# EAGLE design quant_v1 (EAGLE 8.7.1)
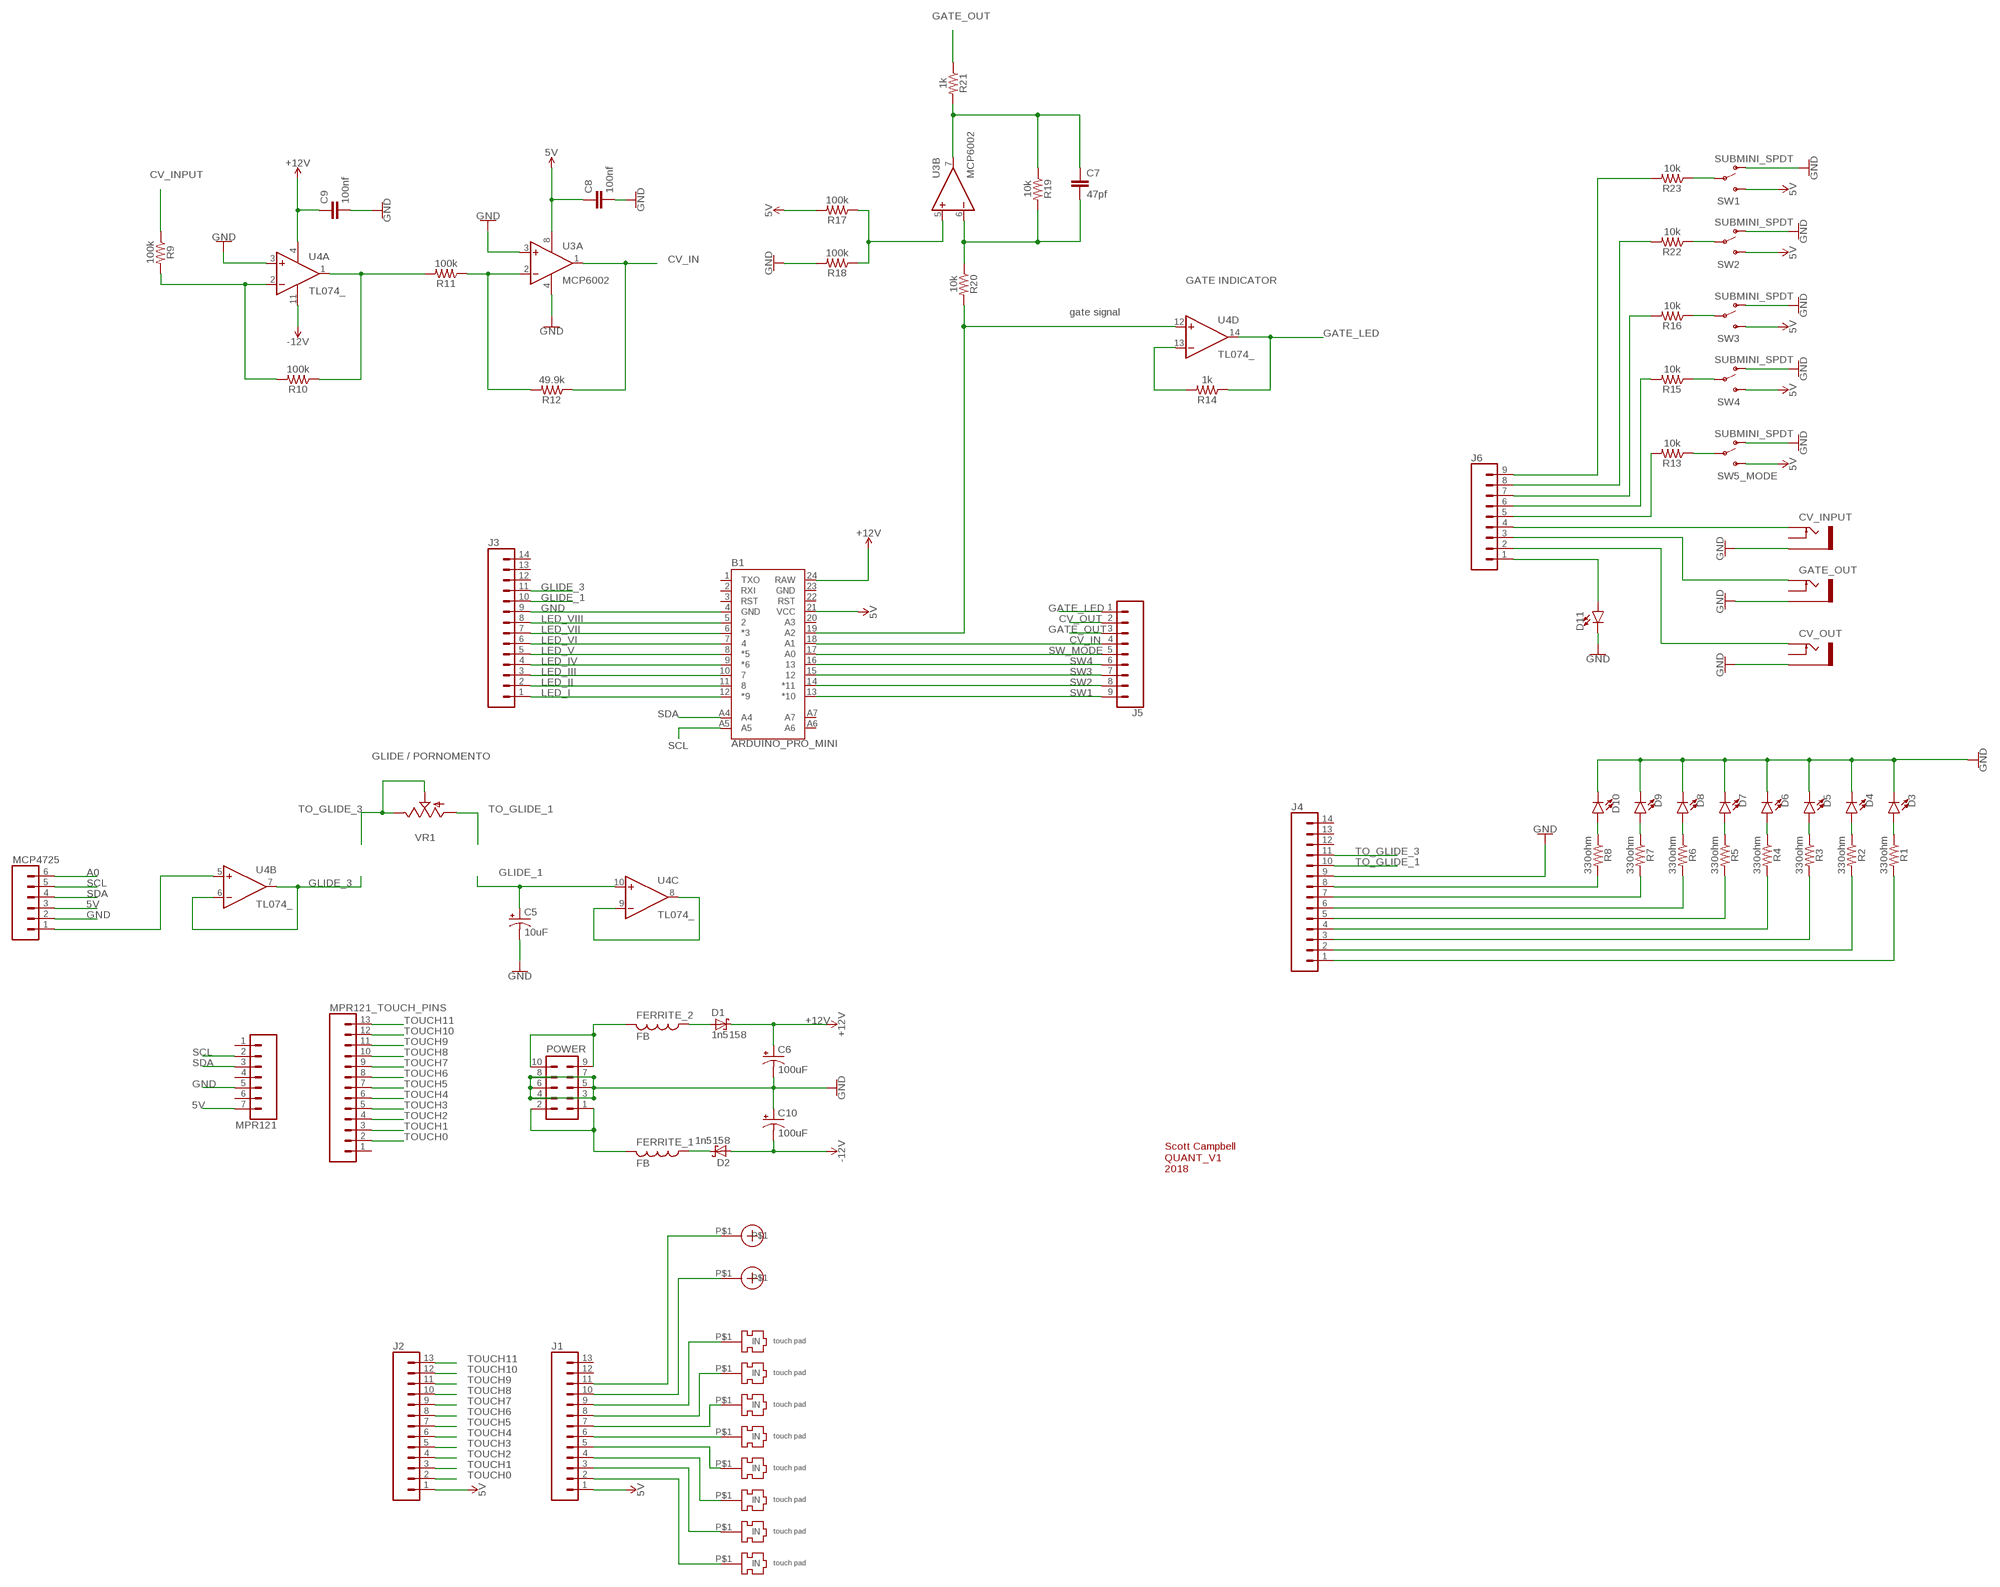
[diagram p0: schematic, sheet 1]

## Parts
B1  ARDUINO_PRO_MINI  [ARDUINO_PRO_MINI]
C5  10uF  10UF-POLAR-RADIAL-2.5MM-25V-20%  [CPOL-RADIAL-2.5MM-5MM]
C6  100uF  100UF-POLAR-RADIAL-2.5MM-25V-20%  [CPOL-RADIAL-2.5MM-6.5MM]
C7  47pf  10NF-PTH-10MM-10000V-1-%  [CAP-PTH-10MM]
C8  100nf  10NF-PTH-10MM-10000V-1-%  [CAP-PTH-10MM]
C9  100nf  10NF-PTH-10MM-10000V-1-%  [CAP-PTH-10MM]
C10  100uF  100UF-POLAR-RADIAL-2.5MM-25V-20%  [CPOL-RADIAL-2.5MM-6.5MM]
CV_INPUT  THONKICONNNEW  [WQP-PJ301M-12_JACK]
CV_OUT  CV_OUT  THONKICONNNEW  [WQP-PJ301M-12_JACK]
D1  1n5158  SCHOTTKY-DIODEDO41  [DO41-10]
D2  1n5158  SCHOTTKY-DIODEDO41  [DO41-10]
D3  LED3MM  [LED_3MM]
D4  LED3MM  [LED_3MM]
D5  LED3MM  [LED_3MM]
D6  LED3MM  [LED_3MM]
D7  LED3MM  [LED_3MM]
D8  LED3MM  [LED_3MM]
D9  LED3MM  [LED_3MM]
D10  LED3MM  [LED_3MM]
D11  LED3MM  [LED_3MM]
FERRITE_1  FB  [FB]
FERRITE_2  FB  [FB]
GATE_OUT  GATE_OUT  THONKICONNNEW  [WQP-PJ301M-12_JACK]
J1  CONN_13  [1X13]
J2  CONN_13  [1X13]
J3  CONN_14  [1X14]
J4  CONN_14  [1X14]
J5  CONN_09  [1X09]
J6  CONN_09  [1X09]
MCP4725  CONN_06NO_SILK_FEMALE_PTH  [1X06_NO_SILK]
MPR121  CONN_07  [1X07]
MPR121_TOUCH_PINS  CONN_13  [1X13]
POWER  EURO_POWER_HEADERREGULAR  [EURO_POWER_HEADER]
R1  330ohm  1KOHM-HORIZ-1/4W-5%  [AXIAL-0.3]
R2  330ohm  1KOHM-HORIZ-1/4W-5%  [AXIAL-0.3]
R3  330ohm  1KOHM-HORIZ-1/4W-5%  [AXIAL-0.3]
R4  330ohm  1KOHM-HORIZ-1/4W-5%  [AXIAL-0.3]
R5  330ohm  1KOHM-HORIZ-1/4W-5%  [AXIAL-0.3]
R6  330ohm  1KOHM-HORIZ-1/4W-5%  [AXIAL-0.3]
R7  330ohm  1KOHM-HORIZ-1/4W-5%  [AXIAL-0.3]
R8  330ohm  1KOHM-HORIZ-1/4W-5%  [AXIAL-0.3]
R9  100k  1KOHM-HORIZ-1/4W-5%  [AXIAL-0.3]
R10  100k  1KOHM-HORIZ-1/4W-5%  [AXIAL-0.3]
R11  100k  1KOHM-HORIZ-1/4W-5%  [AXIAL-0.3]
R12  49.9k  1KOHM-HORIZ-1/4W-5%  [AXIAL-0.3]
R13  10k  1KOHM-HORIZ-1/4W-5%  [AXIAL-0.3]
R14  1k  1KOHM-HORIZ-1/4W-5%  [AXIAL-0.3]
R15  10k  1KOHM-HORIZ-1/4W-5%  [AXIAL-0.3]
R16  10k  1KOHM-HORIZ-1/4W-5%  [AXIAL-0.3]
R17  100k  1KOHM-HORIZ-1/4W-5%  [AXIAL-0.3]
R18  100k  1KOHM-HORIZ-1/4W-5%  [AXIAL-0.3]
R19  10k  1KOHM-HORIZ-1/4W-5%  [AXIAL-0.3]
R20  10k  1KOHM-HORIZ-1/4W-5%  [AXIAL-0.3]
R21  1k  1KOHM-HORIZ-1/4W-5%  [AXIAL-0.3]
R22  10k  1KOHM-HORIZ-1/4W-5%  [AXIAL-0.3]
R23  10k  1KOHM-HORIZ-1/4W-5%  [AXIAL-0.3]
SW1  SUBMINI_SPDT  [SUBMINI_TOGGLE]
SW2  SUBMINI_SPDT  [SUBMINI_TOGGLE]
SW3  SUBMINI_SPDT  [SUBMINI_TOGGLE]
SW4  SUBMINI_SPDT  [SUBMINI_TOGGLE]
SW5_MODE  SUBMINI_SPDT  [SUBMINI_TOGGLE]
TOUCH_I  TOUCH_PAD_ESSY  [TOUCH_PAD_ESSY]
TOUCH_II  TOUCH_PAD_ESSY  [TOUCH_PAD_ESSY]
TOUCH_III  TOUCH_PAD_ESSY  [TOUCH_PAD_ESSY]
TOUCH_IV  TOUCH_PAD_ESSY  [TOUCH_PAD_ESSY]
TOUCH_V  TOUCH_PAD_ESSY  [TOUCH_PAD_ESSY]
TOUCH_VI  TOUCH_PAD_ESSY  [TOUCH_PAD_ESSY]
TOUCH_VII  TOUCH_PAD_ESSY  [TOUCH_PAD_ESSY]
TOUCH_VIII  touch_8  TOUCH_PAD_ESSY  [TOUCH_PAD_ESSY]
U3  MCP6002  TL072_  [DIL08]
U4  TL074_  [DIL14]
U$1  TOUCH_PAD_INCREMENT  [TOUCH_PAD_INCREMENT]
U$2  TOUCH_PAD_INCREMENT  [TOUCH_PAD_INCREMENT]
VR1  9MM_SNAP-IN_POT_  [9MM_SNAP-IN_POT]

## Nets
5V: B1.21(VCC) C8.1 C10.2(-) D2.A J1.1 J2.1 MCP4725.3 MPR121.7 R17.P$2 SW1.3(S) SW2.3(S) SW3.3(S) SW4.3(S) U3.8(P:V+) ; supply symbol labelled -12V
+12V: B1.24(RAW) C6.1(+) C9.1 D1.C U4.4(P:V+)
-12V: U4.11(P:V-)
A0: MCP4725.6
CV_IN: B1.18(A1) J5.4 R12.P$1 U3.1(A:OUT)
CV_INPUT: R9.P$1
CV_OUT: J5.2 U4.8(C:OUT) U4.9(C:-IN)
GATE_LED: J5.1 R14.P$1 U4.14(D:OUT)
GATE_OUT: J5.3 R21.P$1
GLIDE_1: C5.1(+) J3.10 U4.10(C:+IN)
GLIDE_3: J3.11 U4.6(B:-IN) U4.7(B:OUT)
GND: B1.4(GND) C5.2(-) C6.2(-) C8.2 C9.2 C10.1(+) CV_INPUT.P$3_SLEEVE(SLEEVE) CV_OUT.P$3_SLEEVE(SLEEVE) D3.K(C) D4.K(C) D5.K(C) D6.K(C) D7.K(C) D8.K(C) D9.K(C) D10.K(C) D11.K(C) GATE_OUT.P$3_SLEEVE(SLEEVE) J3.9 J4.9 MCP4725.2 MPR121.5 POWER.3 POWER.4 POWER.5 POWER.6 POWER.7 POWER.8 R18.P$2 SW1.1(O) SW2.1(O) SW3.1(O) SW4.1(O) SW5_MODE.1(O) U3.3(A:+IN) U3.4(P:V-) U4.3(A:+IN)
LED_I: B1.12(*9) J3.1
LED_II: B1.11 J3.2
LED_III: B1.10 J3.3
LED_IV: B1.9(*6) J3.4
LED_V: B1.8(*5) J3.5
LED_VI: B1.7 J3.6
LED_VII: B1.6(*3) J3.7
LED_VIII: B1.5 J3.8
N$1: FERRITE_2.P$2 POWER.9 POWER.10
N$2: D2.C FERRITE_1.P$1
N$3: D1.A FERRITE_2.P$1
N$4: R23.P$1 SW1.COM(COMMON)
N$5: D3.A R1.P$1
N$6: R22.P$1 SW2.COM(COMMON)
N$7: R16.P$1 SW3.COM(COMMON)
N$8: R15.P$1 SW4.COM(COMMON)
N$9: J6.9 R23.P$2
N$10: CV_INPUT.P$1_TIP(TIP) J6.4
N$11: J6.7 R16.P$2
N$12: J6.6 R15.P$2
N$13: D10.A R8.P$1
N$14: D9.A R7.P$1
N$15: D8.A R6.P$1
N$16: D7.A R5.P$1
N$17: D6.A R4.P$1
N$18: D5.A R3.P$1
N$19: D4.A R2.P$1
N$20: MCP4725.1 U4.5(B:+IN)
N$21: GATE_OUT.P$1_TIP(TIP) J6.3
N$22: CV_OUT.P$1_TIP(TIP) J6.2
N$23: D11.A J6.1
N$24: R9.P$2 R10.P$2 U4.2(A:-IN)
N$25: J6.8 R22.P$2
N$26: J4.8 R8.P$2
N$27: R13.P$1 SW5_MODE.COM(COMMON)
N$28: R10.P$1 R11.P$2 U4.1(A:OUT)
N$29: R11.P$1 R12.P$2 U3.2(A:-IN)
N$30: R17.P$1 R18.P$1 U3.5(B:+IN)
N$31: J6.5 R13.P$2
N$32: R14.P$2 U4.13(D:-IN)
N$33: J4.7 R7.P$2
N$34: FERRITE_1.P$2 POWER.1 POWER.2
N$35: J4.6 R6.P$2
N$36: J4.5 R5.P$2
N$37: B1.19(A2) R20.P$2 U4.12(D:+IN)
N$38: C7.2 R19.P$2 R20.P$1 U3.6(B:-IN)
N$39: C7.1 R19.P$1 R21.P$2 U3.7(B:OUT)
N$40: J4.4 R4.P$2
N$41: J4.3 R3.P$2
N$42: J4.2 R2.P$2
N$43: J4.1 R1.P$2
N$44: J1.2 TOUCH_I.P$1(IN)
N$45: J1.3 TOUCH_II.P$1(IN)
N$46: J1.4 TOUCH_III.P$1(IN)
N$47: J1.5 TOUCH_IV.P$1(IN)
N$48: J1.6 TOUCH_V.P$1(IN)
N$49: J1.7 TOUCH_VI.P$1(IN)
N$50: J1.8 TOUCH_VII.P$1(IN)
N$51: J1.9 TOUCH_VIII.P$1(IN)
N$52: J1.10 U$2.P$1
N$53: J1.11 U$1.P$1
SCL: B1.A5 MCP4725.5 MPR121.2
SDA: B1.A4 MCP4725.4 MPR121.3
SW1: B1.13(*10) J5.9
SW2: B1.14(*11) J5.8
SW3: B1.15 J5.7
SW4: B1.16 J5.6
SW_MODE: B1.17(A0) J5.5
TO_GLIDE_1: J4.10 VR1.1(A)
TO_GLIDE_3: J4.11 VR1.2(S) VR1.3(E)
TOUCH0: J2.2 MPR121_TOUCH_PINS.2
TOUCH1: J2.3 MPR121_TOUCH_PINS.3
TOUCH2: J2.4 MPR121_TOUCH_PINS.4
TOUCH3: J2.5 MPR121_TOUCH_PINS.5
TOUCH4: J2.6 MPR121_TOUCH_PINS.6
TOUCH5: J2.7 MPR121_TOUCH_PINS.7
TOUCH6: J2.8 MPR121_TOUCH_PINS.8
TOUCH7: J2.9 MPR121_TOUCH_PINS.9
TOUCH8: J2.10 MPR121_TOUCH_PINS.10
TOUCH9: J2.11 MPR121_TOUCH_PINS.11
TOUCH10: J2.12 MPR121_TOUCH_PINS.12
TOUCH11: J2.13 MPR121_TOUCH_PINS.13
Unconnected: B1.1(TXO) B1.2(RXI) B1.3(RST) B1.20(A3) B1.22(RST) B1.A6 B1.A7 CV_INPUT.P$2_SWITCH(SWITCH) CV_OUT.P$2_SWITCH(SWITCH) GATE_OUT.P$2_SWITCH(SWITCH) J1.12 J1.13 J3.12 J3.13 J3.14 J4.12 J4.13 J4.14 MPR121.1 MPR121.4 MPR121.6 MPR121_TOUCH_PINS.1 SW5_MODE.3(S)

## Notes on the sheet
- GATE INDICATOR
- gate signal
- GLIDE / PORNOMENTO
- Scott Campbell
  QUANT_V1
  2018

## Power pins joined to a net without a drawn wire
GND: B1.23(GND)

## Library data of the parts
B1 = SparkFun-Boards:ARDUINO_PRO_MINI: SparkFun Pro Mini Pro Mini compatible footprint. Dimensions: 0.7 x 1.3" PCB Thickness: 0.8mm SparkFun Products: 3.3V/8MHz <https://www.sparkfun.com/products/11114> 5V/16MHz <https://www.sparkfun.com/products/11113>
C5 = SparkFun-Capacitors:10UF-POLAR: 10.0µF polarized capacitors A capacitor is a passive two-terminal electrical component used to store electrical energy temporarily in an electric field.; PROD_ID: CAP-08440
C6 C10 = SparkFun-Capacitors:100UF-POLAR: 100µF polarized capacitors A capacitor is a passive two-terminal electrical component used to store electrical energy temporarily in an electric field.; PROD_ID: CAP-08439
C7-C9 = SparkFun-Capacitors:10NF: 0.01uF/10nF/10,000pF ceramic capacitors A capacitor is a passive two-terminal electrical component used to store electrical energy temporarily in an electric field. CAP-09321; PROD_ID: CAP-09321; VALUE: 10nF
CV_INPUT CV_OUT GATE_OUT = MusicThingModular:THONKICONN: 3.5mm socket for Eurorack modular synths
D1 D2 = adafruit:SCHOTTKY-DIODE: Schottky Diode
D3-D11 = SparkFun-LED:LED: LED (Generic) Standard schematic elements and footprints for 5mm, 3mm, 1206, and 0603 sized LEDs. Generic LEDs with no color specified.; PROD_ID: DIO-08794
FERRITE_1 FERRITE_2 = adafruit:FB: Ferrite bead Digikey #P9821BK-ND
J1 J2 = SparkFun-Connectors:CONN_13: Multi connection point. Often used as Generic Header-pin footprint for 0.1 inch spaced/style header connections On any of the 0.1 inch spaced packages, you can populate with these: Break Away Headers - Straight <https://www.sparkfun.com/products/116> (PRT-00116) Break Away Male Headers - Right Angle <https://www.sparkfun.com/products/553> (PRT-00553) Female Headers <https://www.sparkfun.com/products/115> (PRT-00115) Break Away Headers - Machine Pin <https://www.sparkfun.com/products/117> (PRT-00117) Break Away Female Headers - Swiss Machine Pin <https://www.sparkfun.com/products/743> (PRT-00743) For SCREWTERMINALS and SPRING TERMINALS visit here: Screw Terimnals on SparkFun.com <https://www.sparkfun.com/search/results?term=Screw+Terminals> (5mm/3.5mm/2.54mm spacing) This device is also useful as a general connection point to wire up your design to another part of your project. Our various solder wires solder well into these plated through hole pads. Hook-Up Wire - Assortment (Stranded, 22 AWG) <https://www.sparkfun.com/products/11375> (PRT-11375) Hook-Up Wire - Assortment (Solid Core, 22 AWG) <https://www.sparkfun.com/products/11367> (PRT-11367) View the entire wire category on our website here <https://www.sparkfun.com/categories/141> Special notes: Molex polarized connector foot print use with SKU : PRT-08231 with associated crimp pins and housings. 1MM SMD Version SKU: PRT-10208 NOTES ON THE VARIANTS LOCK and LOCK_LONGPADS... This footprint was designed to help hold the alignment of a through-hole component (i.e. 6-pin header) while soldering it into place. You may notice that each hole has been shifted either up or down by 0.005 of an inch from it's more standard position (which is a perfectly straight line). This slight alteration caused the pins (the squares in the middle) to touch the edges of the holes. Because they are alternating, it causes a "brace" to hold the component in place. 0.005 has proven to be the perfect amount of "off-center" position when using our standard breakaway headers. Although looks a little odd when you look at the bare footprint, once you have a header in there, the alteration is very hard to notice. Also,if you push a header all the way into place, it is covered up entirely on the bottom side.; SPICEPREFIX: X
J3 J4 = SparkFun-Connectors:CONN_14: Multi connection point. Often used as Generic Header-pin footprint for 0.1 inch spaced/style header connections On any of the 0.1 inch spaced packages, you can populate with these: Break Away Headers - Straight <https://www.sparkfun.com/products/116> (PRT-00116) Break Away Male Headers - Right Angle <https://www.sparkfun.com/products/553> (PRT-00553) Female Headers <https://www.sparkfun.com/products/115> (PRT-00115) Break Away Headers - Machine Pin <https://www.sparkfun.com/products/117> (PRT-00117) Break Away Female Headers - Swiss Machine Pin <https://www.sparkfun.com/products/743> (PRT-00743) For SCREWTERMINALS and SPRING TERMINALS visit here: Screw Terimnals on SparkFun.com <https://www.sparkfun.com/search/results?term=Screw+Terminals> (5mm/3.5mm/2.54mm spacing) This device is also useful as a general connection point to wire up your design to another part of your project. Our various solder wires solder well into these plated through hole pads. Hook-Up Wire - Assortment (Stranded, 22 AWG) <https://www.sparkfun.com/products/11375> (PRT-11375) Hook-Up Wire - Assortment (Solid Core, 22 AWG) <https://www.sparkfun.com/products/11367> (PRT-11367) View the entire wire category on our website here <https://www.sparkfun.com/categories/141> Special notes: Molex polarized connector foot print use with SKU : PRT-08231 with associated crimp pins and housings. 1MM SMD Version SKU: PRT-10208 NOTES ON THE VARIANTS LOCK and LOCK_LONGPADS... This footprint was designed to help hold the alignment of a through-hole component (i.e. 6-pin header) while soldering it into place. You may notice that each hole has been shifted either up or down by 0.005 of an inch from it's more standard position (which is a perfectly straight line). This slight alteration caused the pins (the squares in the middle) to touch the edges of the holes. Because they are alternating, it causes a "brace" to hold the component in place. 0.005 has proven to be the perfect amount of "off-center" position when using our standard breakaway headers. Although looks a little odd when you look at the bare footprint, once you have a header in there, the alteration is very hard to notice. Also,if you push a header all the way into place, it is covered up entirely on the bottom side.
J5 J6 = SparkFun-Connectors:CONN_09: Multi connection point. Often used as Generic Header-pin footprint for 0.1 inch spaced/style header connections On any of the 0.1 inch spaced packages, you can populate with these: Break Away Headers - Straight <https://www.sparkfun.com/products/116> (PRT-00116) Break Away Male Headers - Right Angle <https://www.sparkfun.com/products/553> (PRT-00553) Female Headers <https://www.sparkfun.com/products/115> (PRT-00115) Break Away Headers - Machine Pin <https://www.sparkfun.com/products/117> (PRT-00117) Break Away Female Headers - Swiss Machine Pin <https://www.sparkfun.com/products/743> (PRT-00743) For SCREWTERMINALS and SPRING TERMINALS visit here: Screw Terimnals on SparkFun.com <https://www.sparkfun.com/search/results?term=Screw+Terminals> (5mm/3.5mm/2.54mm spacing) This device is also useful as a general connection point to wire up your design to another part of your project. Our various solder wires solder well into these plated through hole pads. Hook-Up Wire - Assortment (Stranded, 22 AWG) <https://www.sparkfun.com/products/11375> (PRT-11375) Hook-Up Wire - Assortment (Solid Core, 22 AWG) <https://www.sparkfun.com/products/11367> (PRT-11367) View the entire wire category on our website here <https://www.sparkfun.com/categories/141> Special notes: Molex polarized connector foot print use with SKU : PRT-08231 with associated crimp pins and housings. 1MM SMD Version SKU: PRT-10208 NOTES ON THE VARIANTS LOCK and LOCK_LONGPADS... This footprint was designed to help hold the alignment of a through-hole component (i.e. 6-pin header) while soldering it into place. You may notice that each hole has been shifted either up or down by 0.005 of an inch from it's more standard position (which is a perfectly straight line). This slight alteration caused the pins (the squares in the middle) to touch the edges of the holes. Because they are alternating, it causes a "brace" to hold the component in place. 0.005 has proven to be the perfect amount of "off-center" position when using our standard breakaway headers. Although looks a little odd when you look at the bare footprint, once you have a header in there, the alteration is very hard to notice. Also,if you push a header all the way into place, it is covered up entirely on the bottom side.
MCP4725 = SparkFun-Connectors:CONN_06: Multi connection point. Often used as Generic Header-pin footprint for 0.1 inch spaced/style header connections On any of the 0.1 inch spaced packages, you can populate with these: Break Away Headers - Straight <https://www.sparkfun.com/products/116> (PRT-00116) Break Away Male Headers - Right Angle <https://www.sparkfun.com/products/553> (PRT-00553) Female Headers <https://www.sparkfun.com/products/115> (PRT-00115) Break Away Headers - Machine Pin <https://www.sparkfun.com/products/117> (PRT-00117) Break Away Female Headers - Swiss Machine Pin <https://www.sparkfun.com/products/743> (PRT-00743) Arduino Stackable Header - 6 Pin <https://www.sparkfun.com/products/9280> (PRT-09280) For SCREWTERMINALS and SPRING TERMINALS visit here: Screw Terimnals on SparkFun.com <https://www.sparkfun.com/search/results?term=Screw+Terminals> (5mm/3.5mm/2.54mm spacing) This device is also useful as a general connection point to wire up your design to another part of your project. Our various solder wires solder well into these plated through hole pads. Hook-Up Wire - Assortment (Stranded, 22 AWG) <https://www.sparkfun.com/products/11375> (PRT-11375) Hook-Up Wire - Assortment (Solid Core, 22 AWG) <https://www.sparkfun.com/products/11367> (PRT-11367) View the entire wire category on our website here <https://www.sparkfun.com/categories/141>; PROD_ID: CONN-08437
MPR121 = SparkFun-Connectors:CONN_07: Multi connection point. Often used as Generic Header-pin footprint for 0.1 inch spaced/style header connections On any of the 0.1 inch spaced packages, you can populate with these: Break Away Headers - Straight <https://www.sparkfun.com/products/116> (PRT-00116) Break Away Male Headers - Right Angle <https://www.sparkfun.com/products/553> (PRT-00553) Female Headers <https://www.sparkfun.com/products/115> (PRT-00115) Break Away Headers - Machine Pin <https://www.sparkfun.com/products/117> (PRT-00117) Break Away Female Headers - Swiss Machine Pin <https://www.sparkfun.com/products/743> (PRT-00743) For SCREWTERMINALS and SPRING TERMINALS visit here: Screw Terimnals on SparkFun.com <https://www.sparkfun.com/search/results?term=Screw+Terminals> (5mm/3.5mm/2.54mm spacing) This device is also useful as a general connection point to wire up your design to another part of your project. Our various solder wires solder well into these plated through hole pads. Hook-Up Wire - Assortment (Stranded, 22 AWG) <https://www.sparkfun.com/products/11375> (PRT-11375) Hook-Up Wire - Assortment (Solid Core, 22 AWG) <https://www.sparkfun.com/products/11367> (PRT-11367) View the entire wire category on our website here <https://www.sparkfun.com/categories/141> Special notes: Molex polarized connector foot print use with SKU : PRT-08231 with associated crimp pins and housings. 1MM SMD Version SKU: PRT-10208 NOTES ON THE VARIANTS LOCK and LOCK_LONGPADS... This footprint was designed to help hold the alignment of a through-hole component (i.e. 6-pin header) while soldering it into place. You may notice that each hole has been shifted either up or down by 0.005 of an inch from it's more standard position (which is a perfectly straight line). This slight alteration caused the pins (the squares in the middle) to touch the edges of the holes. Because they are alternating, it causes a "brace" to hold the component in place. 0.005 has proven to be the perfect amount of "off-center" position when using our standard breakaway headers. Although looks a little odd when you look at the bare footprint, once you have a header in there, the alteration is very hard to notice. Also,if you push a header all the way into place, it is covered up entirely on the bottom side.
MPR121_TOUCH_PINS = SparkFun-Connectors:CONN_13: Multi connection point. Often used as Generic Header-pin footprint for 0.1 inch spaced/style header connections On any of the 0.1 inch spaced packages, you can populate with these: Break Away Headers - Straight <https://www.sparkfun.com/products/116> (PRT-00116) Break Away Male Headers - Right Angle <https://www.sparkfun.com/products/553> (PRT-00553) Female Headers <https://www.sparkfun.com/products/115> (PRT-00115) Break Away Headers - Machine Pin <https://www.sparkfun.com/products/117> (PRT-00117) Break Away Female Headers - Swiss Machine Pin <https://www.sparkfun.com/products/743> (PRT-00743) For SCREWTERMINALS and SPRING TERMINALS visit here: Screw Terimnals on SparkFun.com <https://www.sparkfun.com/search/results?term=Screw+Terminals> (5mm/3.5mm/2.54mm spacing) This device is also useful as a general connection point to wire up your design to another part of your project. Our various solder wires solder well into these plated through hole pads. Hook-Up Wire - Assortment (Stranded, 22 AWG) <https://www.sparkfun.com/products/11375> (PRT-11375) Hook-Up Wire - Assortment (Solid Core, 22 AWG) <https://www.sparkfun.com/products/11367> (PRT-11367) View the entire wire category on our website here <https://www.sparkfun.com/categories/141> Special notes: Molex polarized connector foot print use with SKU : PRT-08231 with associated crimp pins and housings. 1MM SMD Version SKU: PRT-10208 NOTES ON THE VARIANTS LOCK and LOCK_LONGPADS... This footprint was designed to help hold the alignment of a through-hole component (i.e. 6-pin header) while soldering it into place. You may notice that each hole has been shifted either up or down by 0.005 of an inch from it's more standard position (which is a perfectly straight line). This slight alteration caused the pins (the squares in the middle) to touch the edges of the holes. Because they are alternating, it causes a "brace" to hold the component in place. 0.005 has proven to be the perfect amount of "off-center" position when using our standard breakaway headers. Although looks a little odd when you look at the bare footprint, once you have a header in there, the alteration is very hard to notice. Also,if you push a header all the way into place, it is covered up entirely on the bottom side.
POWER = MusicThingModular:EURO_POWER_HEADER: Power Header 10 pin power header for Eurorack Power Supplies Variants with fatter pads for easier soldering, and the LOCK variant which has 5mil offset pins to hold the component in place before soldering
R1-R13 R15-R20 R22 R23 = SparkFun-Resistors:1KOHM: 1kΩ resistor A resistor is a passive two-terminal electrical component that implements electrical resistance as a circuit element. Resistors act to reduce current flow, and, at the same time, act to lower voltage levels within circuits. - Wikipedia; PROD_ID: RES-08380; VALUE: 1k
R14 R21 = SparkFun-Resistors:1KOHM: 1kΩ resistor A resistor is a passive two-terminal electrical component that implements electrical resistance as a circuit element. Resistors act to reduce current flow, and, at the same time, act to lower voltage levels within circuits. - Wikipedia; PROD_ID: RES-08380
SW1-SW4 SW5_MODE = MusicThingModular:SUBMINI_SPDT
TOUCH_I TOUCH_II TOUCH_III TOUCH_IV TOUCH_V TOUCH_VI TOUCH_VII TOUCH_VIII = ESSY:TOUCH_PAD_ESSY
U3 = MusicThingModular:TL072: Generic Dual Op Amp
U4 = MusicThingModular:TL074: Generic Quad Op Amp
U$1 U$2 = ESSY:TOUCH_PAD_INCREMENT
VR1 = MusicThingModular:9MM_SNAP-IN_POT: 9mm vertical snap-in pot, Alpha / Panasonic style

## Board
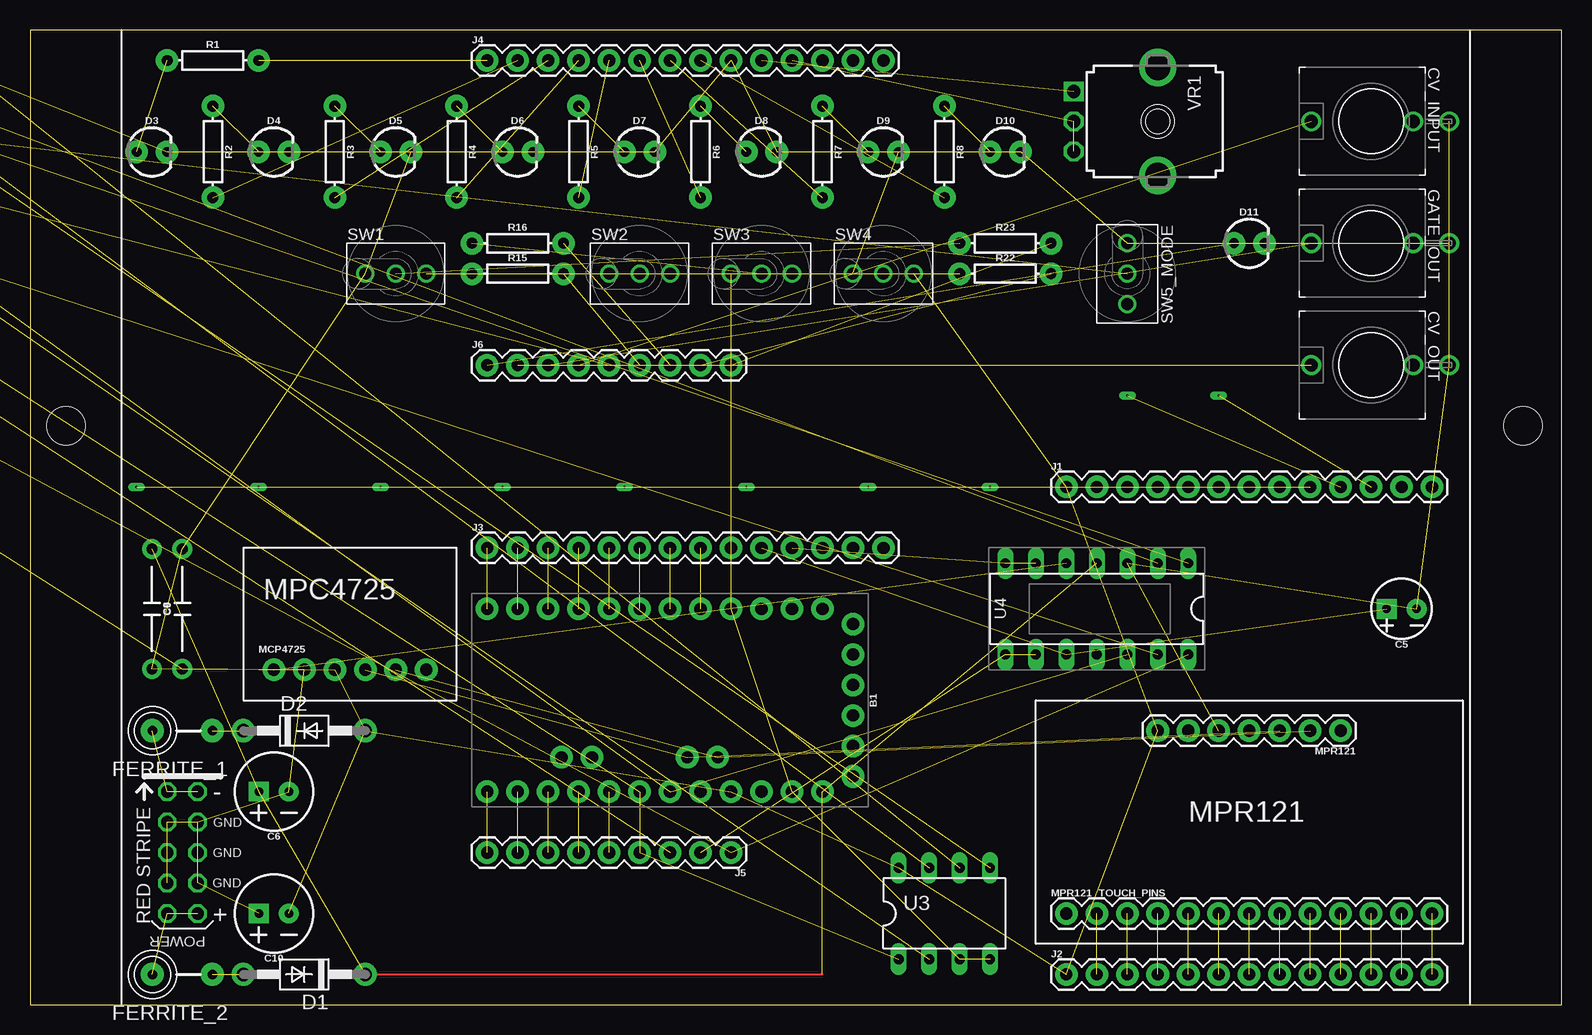
[diagram p1: board, top side]
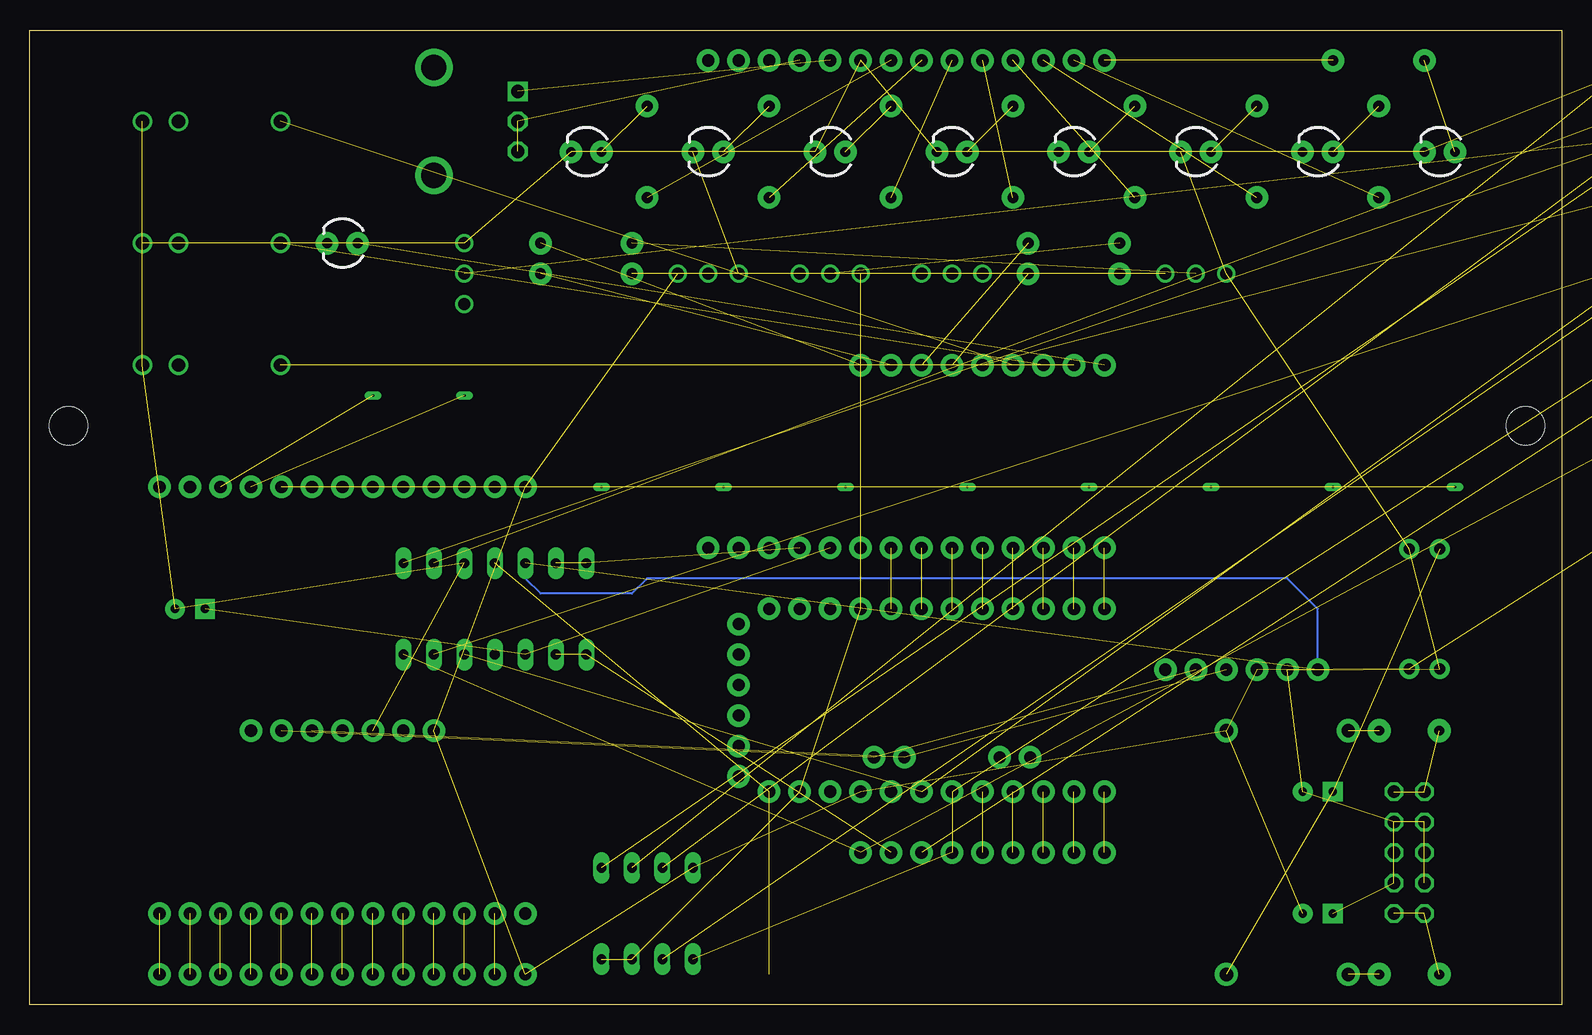
[diagram p2: board, bottom side, seen from below]

Size 127.64 x 81.28 mm. Coordinates in mm from the lower left corner, seen from the top.
Outline: 0,0 127.64,0 127.64,81.28 0,81.27 0,0
Copper layers (1*16): Top 0.035mm / dielectric 1.5mm / Bottom 0.035mm
Design rules "default": minimum track width 6mil, minimum drill 0.35mm, track to track 6mil, track to pad 6mil, pad to pad 6mil, via to via 6mil, smd to smd 6mil, copper to edge 40mil, drill to drill 6mil, minimum pad ring 10mil, minimum via ring 8mil, stop-mask expansion 4mil, vias tented up to drill 0mil, thermal gap 10mil

### Footprints (pad centres in the part's own frame; a part is rotated, then mirrored left to right if it is on the bottom)
ARDUINO_PRO_MINI = drill 1.016 pad 1.88: 1 -7.62,12.7; 2 -7.62,10.16; 3 -7.62,7.62; 4 -7.62,5.08; 5 -7.62,2.54; 6 -7.62,0; 7 -7.62,-2.54; 8 -7.62,-5.08; 9 -7.62,-7.62; 10 -7.62,-10.16; 11 -7.62,-12.7; 12 -7.62,-15.24; 13 7.62,-15.24; 14 7.62,-12.7; 15 7.62,-10.16; 16 7.62,-7.62; 17 7.62,-5.08; 18 7.62,-2.54; 19 7.62,0; 20 7.62,2.54; 21 7.62,5.08; 22 7.62,7.62; 23 7.62,10.16; 24 7.62,12.7; A4 4.763,1.429; A5 4.763,3.969; A6 4.763,-9.049; A7 4.763,-6.509; BLK -6.35,15.24; GND -3.81,15.24; GRN 6.35,15.24; RXI 1.27,15.24; TXO 3.81,15.24; VCC -1.27,15.24
CPOL-RADIAL-2.5MM-5MM = drill 0.7 pad 1.651 square: 1 1.25,0 | drill 0.7 pad 1.651: 2 -1.25,0
CPOL-RADIAL-2.5MM-6.5MM = drill 0.7 pad 1.651 square: 1 1.25,0 | drill 0.7 pad 1.651: 2 -1.25,0
CAP-PTH-10MM = drill 0.9 pad 1.651: 1 -5,0; 2 5,0
WQP-PJ301M-12_JACK = drill 1.1: P$1_TIP 0,5; P$2_SWITCH 0,-3.5; P$3_SLEEVE 0,-6.5
DO41-10 = drill 1.118 pad 1.93: A 5.08,0; C -5.08,0
LED_3MM = drill 0.813 pad 1.88: A -1.27,0; K 1.27,0
FB = drill 0.8 pad 1.93: P$1 -2.5,0; P$2 2.5,0
1X13 = drill 1.016 pad 1.88: 1 0,0; 2 2.54,0; 3 5.08,0; 4 7.62,0; 5 10.16,0; 6 12.7,0; 7 15.24,0; 8 17.78,0; 9 20.32,0; 10 22.86,0; 11 25.4,0; 12 27.94,0; 13 30.48,0
1X14 = drill 1.016 pad 1.88: 1 0,0; 2 2.54,0; 3 5.08,0; 4 7.62,0; 5 10.16,0; 6 12.7,0; 7 15.24,0; 8 17.78,0; 9 20.32,0; 10 22.86,0; 11 25.4,0; 12 27.94,0; 13 30.48,0; 14 33.02,0
1X09 = drill 1.016 pad 1.88: 1 0,0; 2 2.54,0; 3 5.08,0; 4 7.62,0; 5 10.16,0; 6 12.7,0; 7 15.24,0; 8 17.78,0; 9 20.32,0
1X06_NO_SILK = drill 1.016 pad 1.88: 1 0,0; 2 2.54,0; 3 5.08,0; 4 7.62,0; 5 10.16,0; 6 12.7,0
1X07 = drill 1.016 pad 1.88: 1 0,0; 2 2.54,0; 3 5.08,0; 4 7.62,0; 5 10.16,0; 6 12.7,0; 7 15.24,0
EURO_POWER_HEADER = drill 1.016 octagon: 1 -5.08,-1.27; 2 -5.08,1.27; 3 -2.54,-1.27; 4 -2.54,1.27; 5 0,-1.27; 6 0,1.27; 7 2.54,-1.27; 8 2.54,1.27; 9 5.08,-1.27; 10 5.08,1.27
AXIAL-0.3 = drill 0.9 pad 1.88: P$1 -3.81,0; P$2 3.81,0
SUBMINI_TOGGLE = drill 1 pad 1.422: 1 -2.54,0; 3 2.54,0; COM 0,0
TOUCH_PAD_ESSY = drill 0.2 long: P$1 -1.27,-2.54
DIL08 = drill 0.813 pad 1.27 long: 1 -3.81,-3.81; 2 -1.27,-3.81; 3 1.27,-3.81; 4 3.81,-3.81; 5 3.81,3.81; 6 1.27,3.81; 7 -1.27,3.81; 8 -3.81,3.81
DIL14 = drill 0.813 long: 1 -7.62,-3.81; 2 -5.08,-3.81; 3 -2.54,-3.81; 4 0,-3.81; 5 2.54,-3.81; 6 5.08,-3.81; 7 7.62,-3.81; 8 7.62,3.81; 9 5.08,3.81; 10 2.54,3.81; 11 0,3.81; 12 -2.54,3.81; 13 -5.08,3.81; 14 -7.62,3.81
TOUCH_PAD_INCREMENT = drill 0.2 long: P$1 0,0
EURO_PANEL_SCREW_HOLE = hole 3.2: -0.032,0.032
9MM_SNAP-IN_POT = drill 1.1 square: 1 -2.5,-7 | drill 1.1 octagon: 2 0,-7; 3 2.5,-7 | drill 2.1 pad 2.794: CHASSIS1 -4.5,0; CHASSIS2 4.5,0

### Placement (x,y rotation side)
B1  53.34,25.4 270 top
C5  114.3,33.02 180 top
C6  20.32,17.78 180 top
C7  -19.05,85.09 0 top  (outside the outline)
C8  12.7,33.02 90 top
C9  10.16,33.02 270 top
C10  20.32,7.62 180 top
CV_INPUT  111.76,73.66 90 top
CV_OUT  111.76,53.34 90 top
D1  22.86,2.54 180 top
D2  22.86,22.86 0 top
D3  10.16,71.12 0 top
D4  20.32,71.12 0 top
D5  30.48,71.12 0 top
D6  40.64,71.12 0 top
D7  50.8,71.12 0 top
D8  60.96,71.12 0 top
D9  71.12,71.12 0 top
D10  81.28,71.12 0 top
D11  101.6,63.5 0 top
FERRITE_1  12.7,22.86 180 top
FERRITE_2  12.7,2.54 180 top
GATE_OUT  111.76,63.5 90 top
J1  86.36,43.18 0 top
J2  86.36,2.54 0 top
J3  38.1,38.1 0 top
J4  38.1,78.74 0 top
J5  58.42,12.7 180 top
J6  38.1,53.34 0 top
MCP4725  20.32,27.94 0 top
MPR121  109.22,22.86 180 top
MPR121_TOUCH_PINS  86.36,7.62 0 top
POWER  12.7,12.7 270 top
R1  15.24,78.74 0 top
R2  15.24,71.12 270 top
R3  25.4,71.12 270 top
R4  35.56,71.12 270 top
R5  45.72,71.12 270 top
R6  55.88,71.12 270 top
R7  66.04,71.12 270 top
R8  76.2,71.12 270 top
R9  -68.58,73.66 0 top  (outside the outline)
R10  -17.78,77.47 0 top  (outside the outline)
R11  -27.94,77.47 0 top  (outside the outline)
R12  -38.1,77.47 0 top  (outside the outline)
R13  -48.26,77.47 0 top  (outside the outline)
R14  -58.42,77.47 0 top  (outside the outline)
R15  40.64,60.96 0 top
R16  40.64,63.5 0 top
R17  -68.58,77.47 0 top  (outside the outline)
R18  -17.78,81.28 0 top  (outside the outline)
R19  -27.94,81.28 0 top  (outside the outline)
R20  -38.1,81.28 0 top  (outside the outline)
R21  -48.26,81.28 0 top  (outside the outline)
R22  81.28,60.96 0 top
R23  81.28,63.5 0 top
SW1  30.48,60.96 0 top
SW2  50.8,60.96 0 top
SW3  60.96,60.96 0 top
SW4  71.12,60.96 0 top
SW5_MODE  91.44,60.96 270 top
TOUCH_I  10.16,45.72 0 top
TOUCH_II  20.32,45.72 0 top
TOUCH_III  30.48,45.72 0 top
TOUCH_IV  40.64,45.72 0 top
TOUCH_V  50.8,45.72 0 top
TOUCH_VI  60.96,45.72 0 top
TOUCH_VII  71.12,45.72 0 top
TOUCH_VIII  81.28,45.72 0 top
U3  76.2,7.62 0 top
U4  88.9,33.02 180 top
U$1  99.06,50.8 0 top
U$2  91.44,50.8 180 top
U$3  [EURO_PANEL_SCREW_HOLE]  3.04,48.26 0 top
U$4  [EURO_PANEL_SCREW_HOLE]  124.46,48.26 0 top
VR1  93.98,73.66 270 top

### Tracks (layer width: path | path; a pad name or v marks a point on that pad's centre or on a via)
5V  (13 unrouted)
+12V  (4 unrouted)
  Top 0.152: D1.C 66.04,2.54
CV_IN  (3 unrouted)
CV_OUT  (2 unrouted)
GATE_LED  (2 unrouted)
GATE_OUT  (1 unrouted)
GLIDE_1  (2 unrouted)
GLIDE_3  (2 unrouted)
GND  (37 unrouted)
LED_I  (1 unrouted)
LED_II  (1 unrouted)
LED_III  (1 unrouted)
LED_IV  (1 unrouted)
LED_V  (1 unrouted)
LED_VI  (1 unrouted)
LED_VII  (1 unrouted)
LED_VIII  (1 unrouted)
N$1  (2 unrouted)
N$2  (1 unrouted)
N$3  (1 unrouted)
N$4  (1 unrouted)
N$5  (1 unrouted)
N$6  (1 unrouted)
N$7  (1 unrouted)
N$8  (1 unrouted)
N$9  (1 unrouted)
N$10  (1 unrouted)
N$11  (1 unrouted)
N$12  (1 unrouted)
N$13  (1 unrouted)
N$14  (1 unrouted)
N$15  (1 unrouted)
N$16  (1 unrouted)
N$17  (1 unrouted)
N$18  (1 unrouted)
N$19  (1 unrouted)
N$20  (1 unrouted)
  Bottom 0.152: MCP4725.1 20.32,33.02 22.86,35.56 76.2,35.56 77.47,34.29 85.09,34.29 86.36,35.56 U4.5
N$21  (1 unrouted)
N$22  (1 unrouted)
N$23  (1 unrouted)
N$24  (2 unrouted)
N$25  (1 unrouted)
N$26  (1 unrouted)
N$27  (1 unrouted)
N$28  (2 unrouted)
N$29  (2 unrouted)
N$30  (2 unrouted)
N$31  (1 unrouted)
N$32  (1 unrouted)
N$33  (1 unrouted)
N$34  (2 unrouted)
N$35  (1 unrouted)
N$36  (1 unrouted)
N$37  (2 unrouted)
N$38  (3 unrouted)
N$39  (3 unrouted)
N$40  (1 unrouted)
N$41  (1 unrouted)
N$42  (1 unrouted)
N$43  (1 unrouted)
N$44  (1 unrouted)
N$45  (1 unrouted)
N$46  (1 unrouted)
N$47  (1 unrouted)
N$48  (1 unrouted)
N$49  (1 unrouted)
N$50  (1 unrouted)
N$51  (1 unrouted)
N$52  (1 unrouted)
N$53  (1 unrouted)
SCL  (2 unrouted)
SDA  (2 unrouted)
SW1  (1 unrouted)
SW2  (1 unrouted)
SW3  (1 unrouted)
SW4  (1 unrouted)
SW_MODE  (1 unrouted)
TO_GLIDE_1  (1 unrouted)
TO_GLIDE_3  (2 unrouted)
TOUCH0  (1 unrouted)
TOUCH1  (1 unrouted)
TOUCH2  (1 unrouted)
TOUCH3  (1 unrouted)
TOUCH4  (1 unrouted)
TOUCH5  (1 unrouted)
TOUCH6  (1 unrouted)
TOUCH7  (1 unrouted)
TOUCH8  (1 unrouted)
TOUCH9  (1 unrouted)
TOUCH10  (1 unrouted)
TOUCH11  (1 unrouted)

### Text on the board
_tsilk: MPC4725 | MPR121